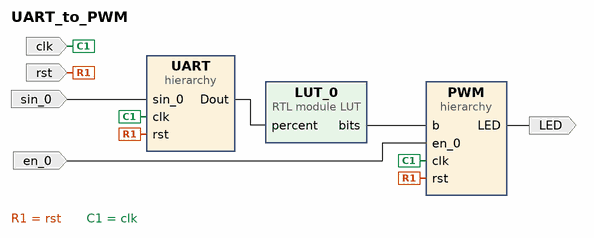
[diagram p0: block diagram of the top level]
# Vivado block design UART_to_PWM, xc7z020clg400-1, Vivado 2020.2
create_bd_design UART_to_PWM

create_bd_port -dir O LED
create_bd_port -dir I sin_0
create_bd_port -dir I en_0
create_bd_port -dir I -type clk clk
set_property -dict {CONFIG.FREQ_HZ 125000000} [get_bd_ports clk]
create_bd_port -dir I rst

create_bd_cell -type module -reference LUT LUT_0
create_bd_cell -type hier PWM
create_bd_cell -type hier UART

# ---- hierarchy /PWM ----
current_bd_instance /PWM
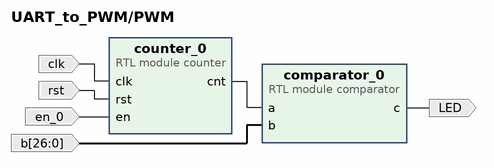
[diagram p1: block diagram inside /PWM]
create_bd_pin -dir I -type clk clk
create_bd_pin -dir I rst
create_bd_pin -dir I en_0
create_bd_pin -dir I -from 26 -to 0 b
create_bd_pin -dir O LED

create_bd_cell -type module -reference counter counter_0
create_bd_cell -type module -reference comparator comparator_0

# ---- hierarchy /UART ----
current_bd_instance /UART
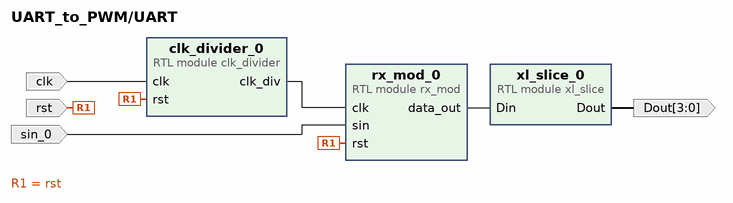
[diagram p2: block diagram inside /UART]
create_bd_pin -dir I -type clk clk
create_bd_pin -dir I rst
create_bd_pin -dir I sin_0
create_bd_pin -dir O -from 3 -to 0 Dout

create_bd_cell -type module -reference clk_divider clk_divider_0
create_bd_cell -type module -reference xl_slice xl_slice_0
create_bd_cell -type module -reference rx_mod rx_mod_0

# ---- connections ----

current_bd_instance /PWM
connect_bd_net [get_bd_pins counter_0/cnt] [get_bd_pins comparator_0/a]
connect_bd_net [get_bd_pins clk] [get_bd_pins counter_0/clk]
connect_bd_net [get_bd_pins rst] [get_bd_pins counter_0/rst]
connect_bd_net -net en_0_1 [get_bd_pins en_0] [get_bd_pins counter_0/en]
connect_bd_net -net LUT_0_bits [get_bd_pins b] [get_bd_pins comparator_0/b]
connect_bd_net [get_bd_pins comparator_0/c] [get_bd_pins LED]

current_bd_instance /UART
connect_bd_net [get_bd_pins clk_divider_0/clk_div] [get_bd_pins rx_mod_0/clk]
connect_bd_net [get_bd_pins rx_mod_0/data_out] [get_bd_pins xl_slice_0/Din]
connect_bd_net [get_bd_pins clk] [get_bd_pins clk_divider_0/clk]
connect_bd_net [get_bd_pins rst] [get_bd_pins clk_divider_0/rst] [get_bd_pins rx_mod_0/rst]
connect_bd_net -net sin_0_1 [get_bd_pins sin_0] [get_bd_pins rx_mod_0/sin]
connect_bd_net [get_bd_pins xl_slice_0/Dout] [get_bd_pins Dout]

current_bd_instance /
connect_bd_net [get_bd_ports rst] [get_bd_pins PWM/rst] [get_bd_pins UART/rst]
connect_bd_net -net xl_slice_0_Dout [get_bd_pins UART/Dout] [get_bd_pins LUT_0/percent]
connect_bd_net [get_bd_pins LUT_0/bits] [get_bd_pins PWM/b]
connect_bd_net [get_bd_ports clk] [get_bd_pins PWM/clk] [get_bd_pins UART/clk]
connect_bd_net -net comparator_0_c [get_bd_pins PWM/LED] [get_bd_ports LED]
connect_bd_net -net sin_0_1 [get_bd_ports sin_0] [get_bd_pins UART/sin_0]
connect_bd_net -net en_0_1 [get_bd_ports en_0] [get_bd_pins PWM/en_0]

validate_bd_design
save_bd_design
